# Altium project F3000.PrjPCB
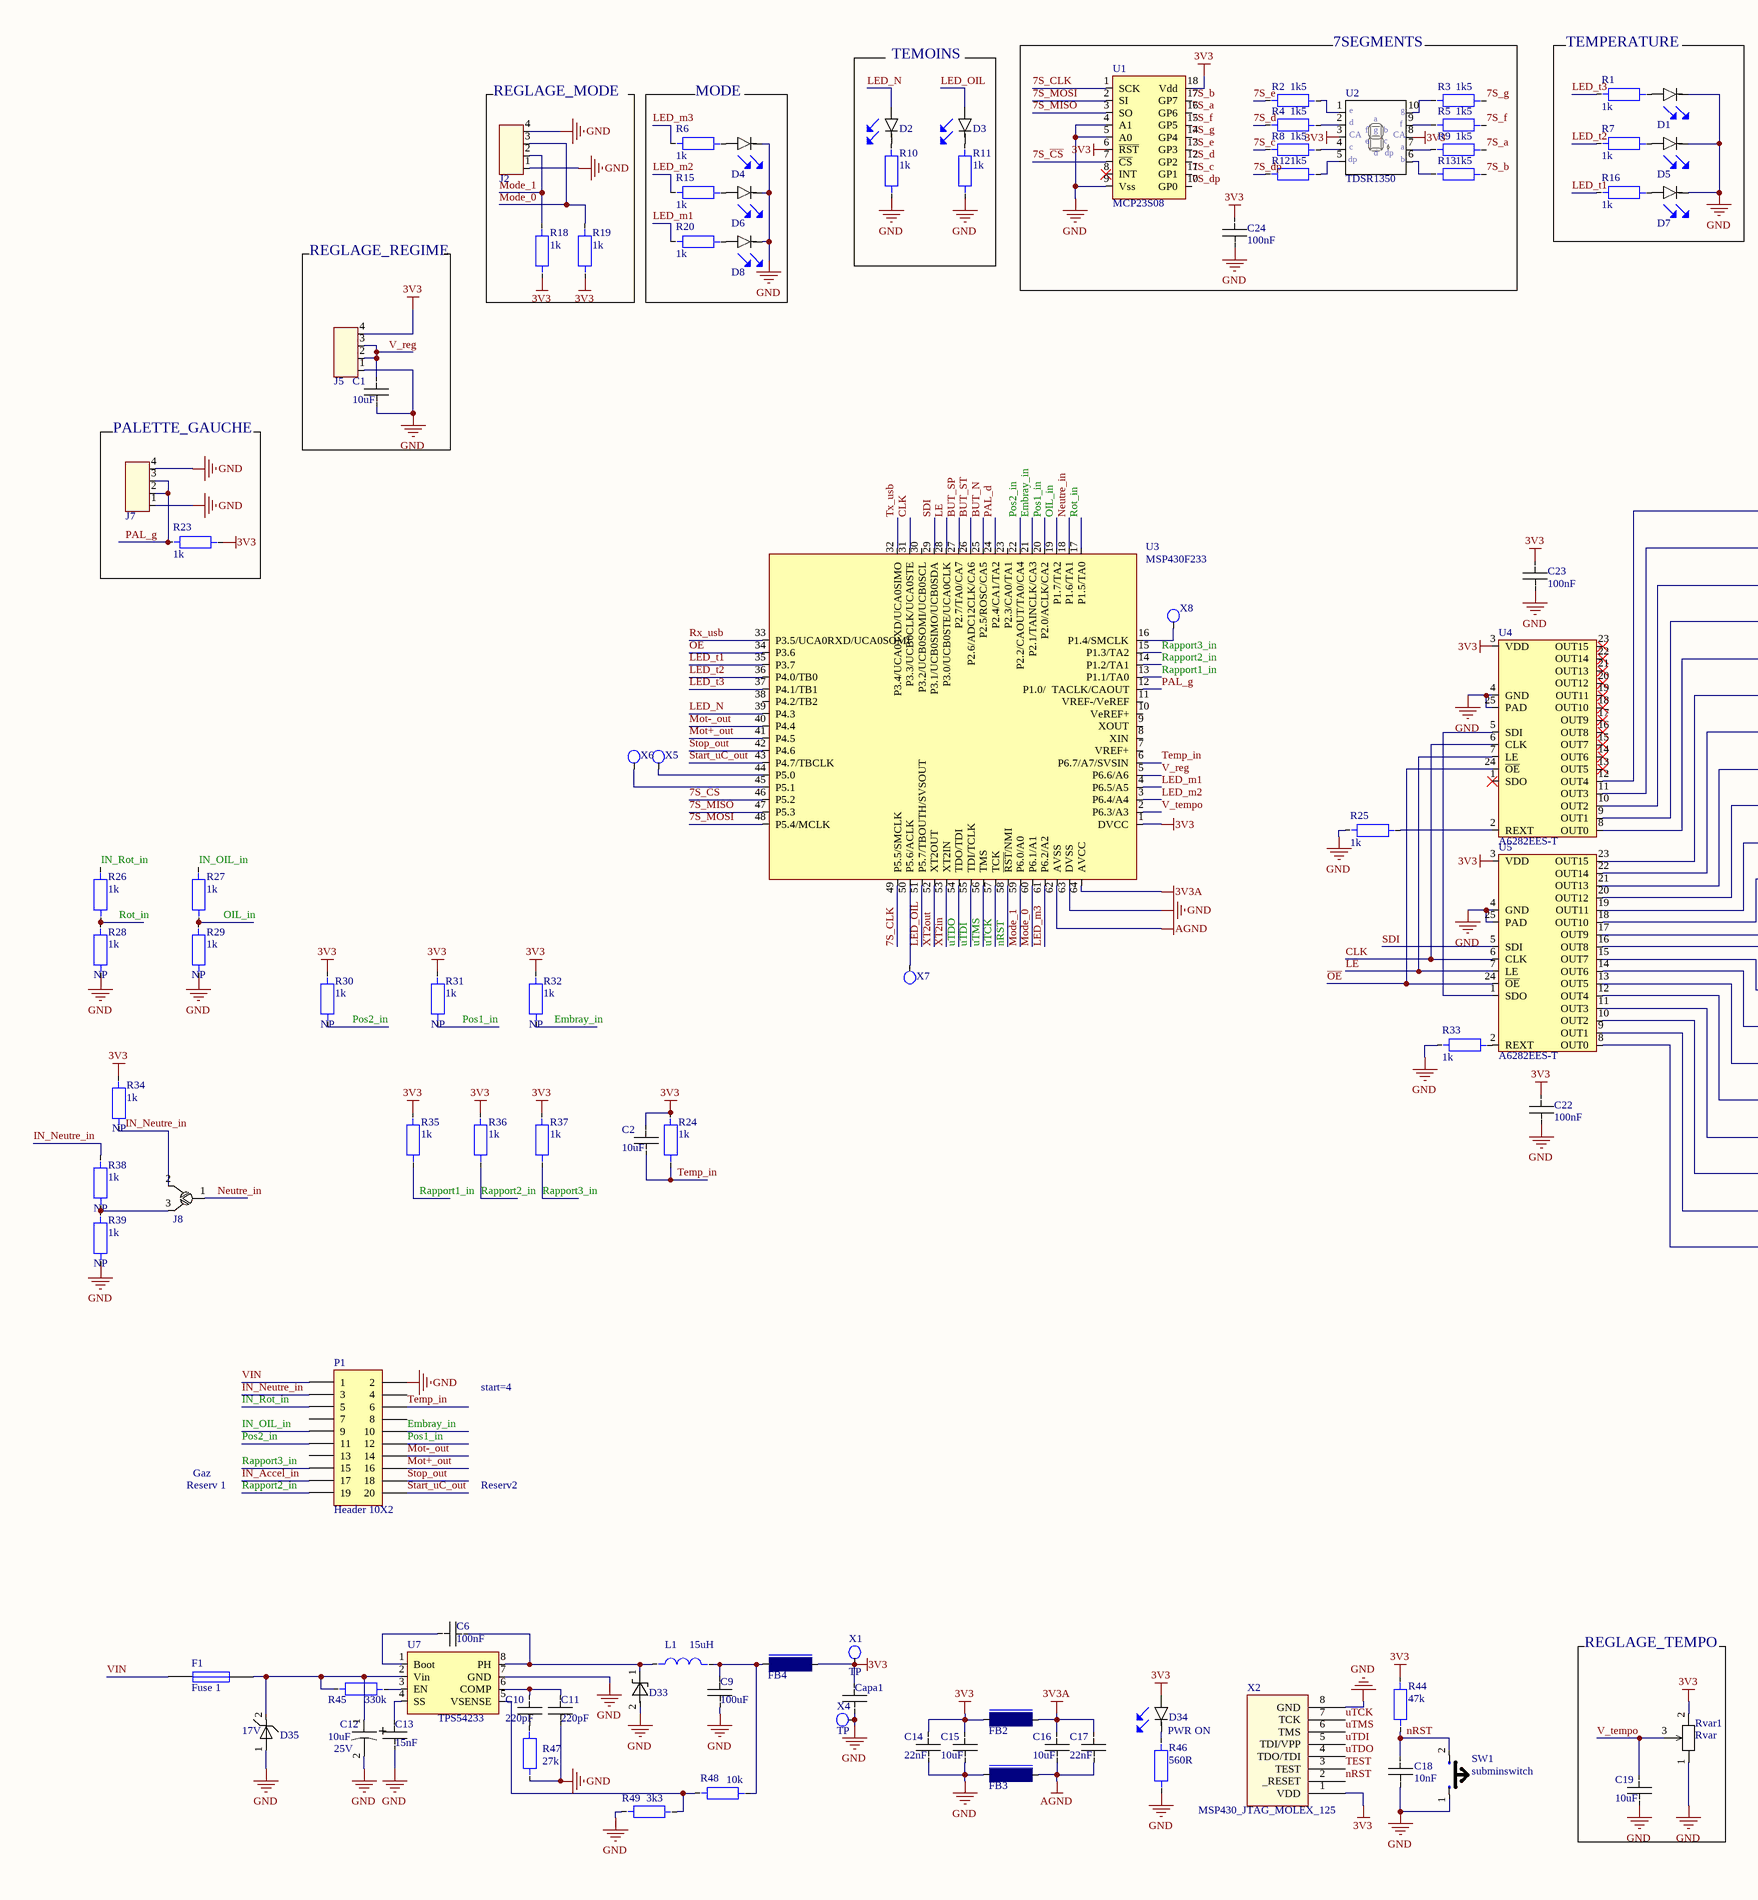
[diagram p0: scheme.SchDoc, left]
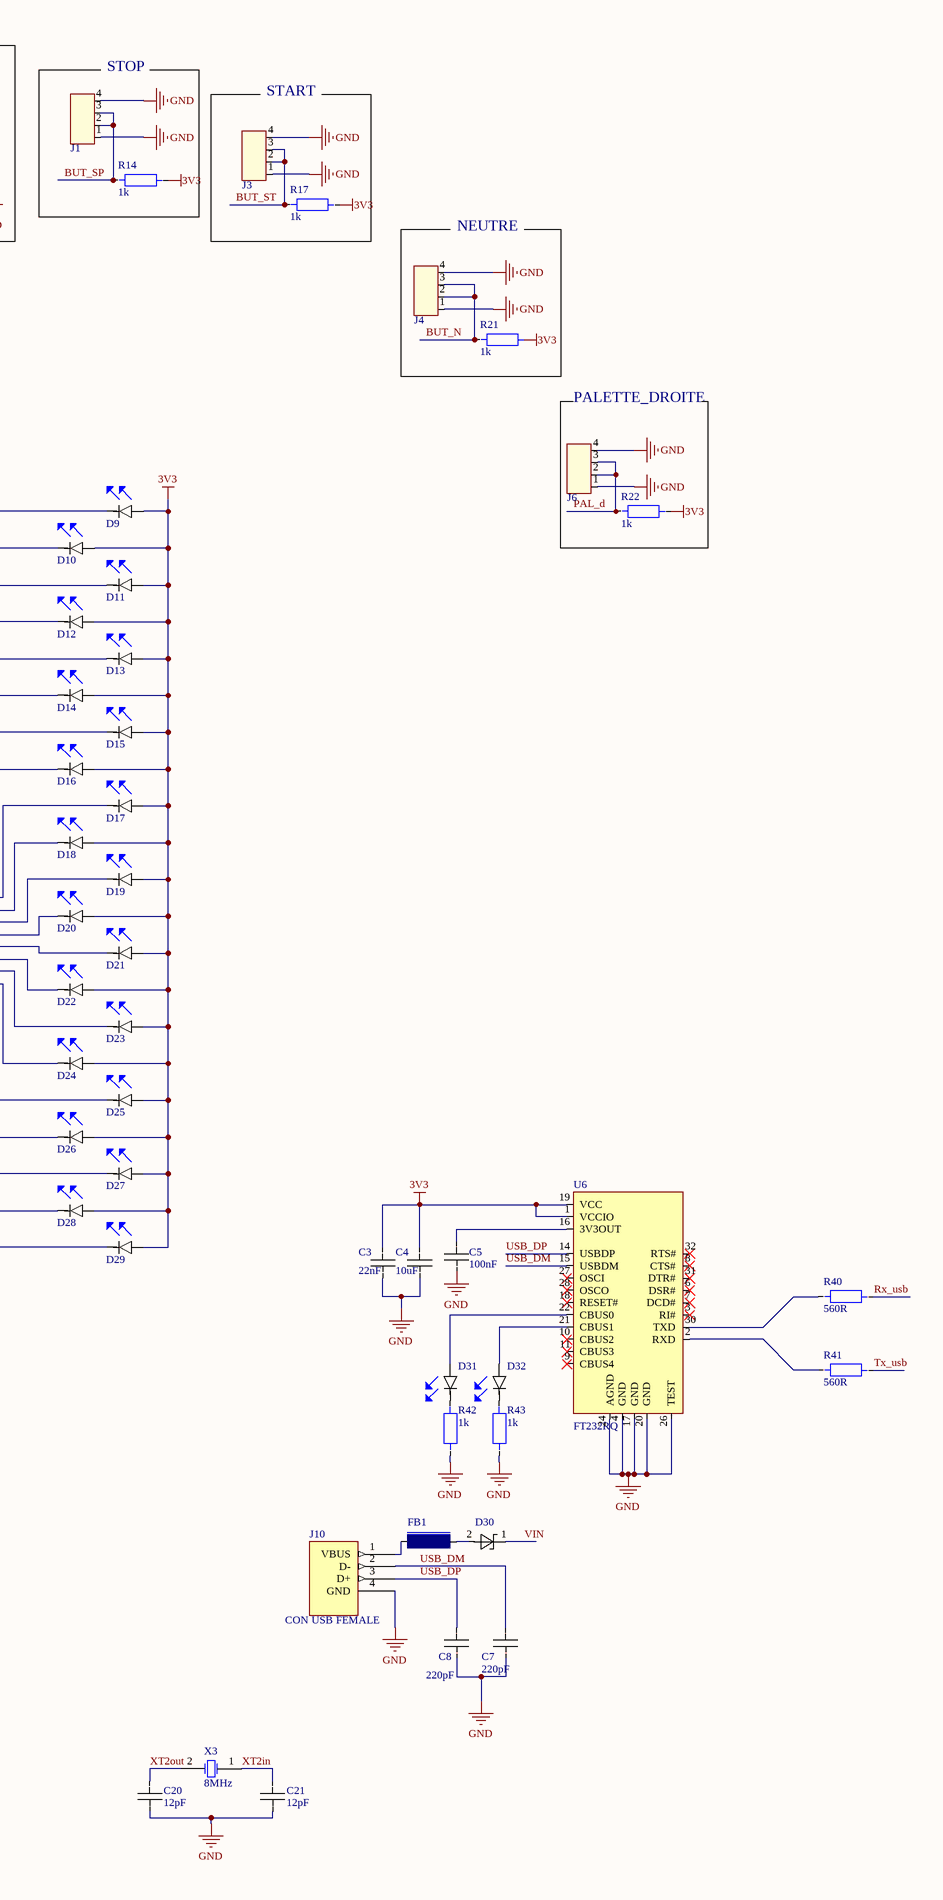
[diagram p1: scheme.SchDoc, right]
1 sheet, 142 parts. Net scope: global (net labels, ports and power ports of the same name join across sheets).
Board file: pcb.PcbDoc

## Sheet scheme.SchDoc
size A2; PageSetup: Record=PageOptions|CenterHorizontal=True|CenterVertical=True|PrintScale=0.50|XCorrection=1.00|YCorrection=1.00|PrintKind=1|BorderSize=5000000|LeftOffset=0|BottomOffset=0|Orientation=2|PaperLength=1000|PaperWidth=1000|Scale=100|PaperSource=7|PrintQuality=600|MediaType=1|DitherType=10|PaperKind=A4 (210 x 297 mm)|PrintScaleMode=1

### Parts
C1  value 10uF  [0603c]  (hidden comment: C)
C2  value 10uF  [0402]  (hidden comment: C)
C3  value 22nF  [0603c]  (hidden comment: C)
C4  value 10uF  [0603c]  (hidden comment: C)
C5  value 100nF  [0603c]  (hidden comment: C)
C6  value 100nF  [0603c]  (hidden comment: C)
C7  value 220pF  [0603c]  (hidden comment: C)
C8  value 220pF  [0603c]  (hidden comment: C)
C9  value 100uF  [1206]  (hidden comment: C)
C10  value 220pF  [0603c]  (hidden comment: C)
C11  value 220pF  [0603c]  (hidden comment: C)
C12  value 10uF  Voltage: 25V  [Cpol]  (hidden comment: C_pol)
C13  value 15nF  [0603c]  (hidden comment: C)
C14  value 22nF  [0603c]  (hidden comment: C)
C15  value 10uF  [0603c]  (hidden comment: C)
C16  value 10uF  [0603c]  (hidden comment: C)
C17  value 22nF  [0603c]  (hidden comment: C)
C18  value 10nF  [0603c]  (hidden comment: C)
C19  value 10uF  [0603c]  (hidden comment: C)
C20  value 12pF  [0603c]  (hidden comment: C)
C21  value 12pF  [0603c]  (hidden comment: C)
C22  value 100nF  [0603c]  (hidden comment: C)
C23  value 100nF  [0603c]  (hidden comment: C)
C24  value 100nF  [0603c]  (hidden comment: C)
Capa1  C  [0603c]  (value not drawn)
D1  led  [LED5MM]  (value not drawn)
D2  led  [LED5MM]  (value not drawn)
D3  led  [LED5MM]  (value not drawn)
D4  led  [LED3mm]  (value not drawn)
D5  led  [LED3mm]  (value not drawn)
D6  led  [LED3mm]  (value not drawn)
D7  led  [LED3mm]  (value not drawn)
D8  led  [LED3mm]  (value not drawn)
D9  led  [LED3mm]  (value not drawn)
D10  led  [LED3mm]  (value not drawn)
D11  led  [LED3mm]  (value not drawn)
D12  led  [LED3mm]  (value not drawn)
D13  led  [LED3mm]  (value not drawn)
D14  led  [LED3mm]  (value not drawn)
D15  led  [LED3mm]  (value not drawn)
D16  led  [LED3mm]  (value not drawn)
D17  led  [LED3mm]  (value not drawn)
D18  led  [LED3mm]  (value not drawn)
D19  led  [LED3mm]  (value not drawn)
D20  led  [LED3mm]  (value not drawn)
D21  led  [LED3mm]  (value not drawn)
D22  led  [LED3mm]  (value not drawn)
D23  led  [LED3mm]  (value not drawn)
D24  led  [LED3mm]  (value not drawn)
D25  led  [LED3mm]  (value not drawn)
D26  led  [LED3mm]  (value not drawn)
D27  led  [LED3mm]  (value not drawn)
D28  led  [LED3mm]  (value not drawn)
D29  led  [LED3mm]  (value not drawn)
D30  Schottky  [SOD323]  (value not drawn)
D31  led  [0805]  (value not drawn)
D32  led  [0805]  (value not drawn)
D33  Schottky  [SOD323]  (value not drawn)
D34  utility: PWR ON  [0805]  (hidden comment: led)
D35  Vz: 17V  [R_dil_vertical]  (hidden comment: Zener)
F1  Fuse 1  [R_DIL_vertical]
FB1  FB  [0805]  (value not drawn)
FB2  FB  [0805]  (value not drawn)
FB3  FB  [0805]  (value not drawn)
FB4  FB  [0805]  (value not drawn)
J1  MOLEX_embase_4_voies  [MOLEX53047-0410]  (value not drawn)
J2  MOLEX_embase_4_voies  [MOLEX53047-0410]  (value not drawn)
J3  MOLEX_embase_4_voies  [MOLEX53047-0410]  (value not drawn)
J4  MOLEX_embase_4_voies  [MOLEX53047-0410]  (value not drawn)
J5  MOLEX_embase_4_voies  [MOLEX53047-0410]  (value not drawn)
J6  MOLEX_embase_4_voies  [MOLEX53047-0410]  (value not drawn)
J7  MOLEX_embase_4_voies  [MOLEX53047-0410]  (value not drawn)
J8  solder_bridge_3  [solder_bridge_3]  (value not drawn)
J10  CON USB FEMALE  [mini_USB_vertical]
L1  value 15uH  [C1812]  (hidden comment: L)
P1  Header 10X2  [header2x10]
R1  value 1k  [0603c]  (hidden comment: R)
R2  value 1k5  [0603c]  (hidden comment: R)
R3  value 1k5  [0603c]  (hidden comment: R)
R4  value 1k5  [0603c]  (hidden comment: R)
R5  value 1k5  [0603c]  (hidden comment: R)
R6  value 1k  [0603c]  (hidden comment: R)
R7  value 1k  [0603c]  (hidden comment: R)
R8  value 1k5  [0603c]  (hidden comment: R)
R9  value 1k5  [0603c]  (hidden comment: R)
R10  value 1k  [0603c]  (hidden comment: R)
R11  value 1k  [0603c]  (hidden comment: R)
R12  value 1k5  [0603c]  (hidden comment: R)
R13  value 1k5  [0603c]  (hidden comment: R)
R14  value 1k  [0603c]  (hidden comment: R)
R15  value 1k  [0603c]  (hidden comment: R)
R16  value 1k  [0603c]  (hidden comment: R)
R17  value 1k  [0603c]  (hidden comment: R)
R18  value 1k  [0603c]  (hidden comment: R)
R19  value 1k  [0603c]  (hidden comment: R)
R20  value 1k  [0603c]  (hidden comment: R)
R21  value 1k  [0603c]  (hidden comment: R)
R22  value 1k  [0603c]  (hidden comment: R)
R23  value 1k  [0603c]  (hidden comment: R)
R24  value 1k  [0402]  (hidden comment: R)
R25  value 1k  [0603c]  (hidden comment: R)
R26  value 1k  [0402]  (hidden comment: R)
R27  value 1k  [0402]  (hidden comment: R)
R28  value 1k  Status: NP  [0402]  (hidden comment: R)
R29  value 1k  Status: NP  [0402]  (hidden comment: R)
R30  value 1k  Status: NP  [0402]  (hidden comment: R)
R31  value 1k  Status: NP  [0402]  (hidden comment: R)
R32  value 1k  Status: NP  [0402]  (hidden comment: R)
R33  value 1k  [0603c]  (hidden comment: R)
R34  value 1k  Status: NP  [0402]  (hidden comment: R)
R35  value 1k  [0402]  (hidden comment: R)
R36  value 1k  [0402]  (hidden comment: R)
R37  value 1k  [0402]  (hidden comment: R)
R38  value 1k  Status: NP  [0402]  (hidden comment: R)
R39  value 1k  Status: NP  [0402]  (hidden comment: R)
R40  value 560R  [0603c]  (hidden comment: R)
R41  value 560R  [0603c]  (hidden comment: R)
R42  value 1k  [0603c]  (hidden comment: R)
R43  value 1k  [0603c]  (hidden comment: R)
R44  value 47k  [0603c]  (hidden comment: R)
R45  value 330k  [0603c]  (hidden comment: R)
R46  value 560R  [0603c]  (hidden comment: R)
R47  value 27k  [0603c]  (hidden comment: R)
R48  value 10k  [0603c]  (hidden comment: R)
R49  value 3k3  [0603c]  (hidden comment: R)
Rvar1  Rvar  [TC33X-2]
SW1  subminswitch  [microswitch]
U1  MCP23S08  [SOIC18]
U2  TDSR1350  [TDSR1350]
U3  MSP430F233  [PQFP-64]
U4  A6282EES-T  [QFN24]
U5  A6282EES-T  [QFN24]
U6  FT232RQ  [FT232RQ_QFN32_M]
U7  TPS54233  [SOIC127P600-8M]
X1  TP  [TP]
X2  MSP430_JTAG_MOLEX_125  [JTAG_MSP_SMALL]
X3  8MHz  [Quartz_2]
X4  TP  [TP]
X5  TP  [cms_pad]  (value not drawn)
X6  TP  [cms_pad]  (value not drawn)
X7  TP  [cms_pad]  (value not drawn)
X8  TP  [cms_pad]  (value not drawn)

### Nets
3V3: C2.1 C3.1 C4.1 C14.1 C15.1 C22.1 C23.1 C24.1 Capa1.1 D9.1 D10.1 D11.1 D12.1 D13.1 D14.1 D15.1 D16.1 D17.1 D18.1 D19.1 D20.1 D21.1 D22.1 D23.1 D24.1 D25.1 D26.1 D27.1 D28.1 D29.1 D34.1 FB2.1 FB4.2 J5.4 R14.2 R17.2 R18.1 R19.1 R21.2 R22.2 R23.2 R24.2 R30.2 R31.2 R32.2 R34.2 R35.2 R36.2 R37.2 R44.2 Rvar1.2 U1.6(~{RST}) U1.18(Vdd) U2.3 U2.8 U3.1(DVCC) U4.3(VDD) U5.3(VDD) U6.1(VCCIO) U6.19(VCC) X1.1 X2.1(VDD)
3V3A: C16.1 C17.1 FB2.2 U3.64(AVCC)
AGND: C16.2 C17.2 FB3.2 U3.62(AVSS)
GND: C1.2 C3.2 C4.2 C5.2 C7.2 C8.2 C9.2 C11.2 C12.2 C13.2 C14.2 C15.2 C18.1 C19.2 C20.2 C21.2 C22.2 C23.2 C24.2 Capa1.2 D1.2 D4.2 D5.2 D6.2 D7.2 D8.2 D33.2 D35.1 FB3.1 J1.1 J1.4 J2.1 J2.4 J3.1 J3.4 J4.1 J4.4 J5.1 J6.1 J6.4 J7.1 J7.4 J10.4(GND) J10.5(SHIELD) J10.6(SHIELD) P1.2 R10.2 R11.2 R25.2 R28.1 R29.1 R33.2 R39.1 R42.1 R43.1 R46.2 R47.2 R49.1 Rvar1.1 SW1.1 U1.4(A1) U1.5(A0) U1.9(Vss) U3.63(DVSS) U4.4(GND) U4.25(PAD) U5.4(GND) U5.25(PAD) U6.4(GND) U6.17(GND) U6.20(GND) U6.24(AGND) U6.26(TEST) U7.7(GND) X2.8(GND) X4.1
7S_a: R9.2 U1.16(GP6)
7S_b: R13.2 U1.17(GP7)
7S_c: R8.1 U1.11(GP1)
7S_~{CS}: U1.7(~{CS}) U3.46(P5.2)
7S_CLK: U1.1(SCK) U3.49(P5.5/SMCLK)
7S_d: R4.1 U1.12(GP2)
7S_dp: R12.1 U1.10(GP0)
7S_e: R2.1 U1.13(GP3)
7S_f: R5.2 U1.15(GP5)
7S_g: R3.2 U1.14(GP4)
7S_MISO: U1.3(SO) U3.47(P5.3)
7S_MOSI: U1.2(SI) U3.48(P5.4/MCLK)
BUT_N: J4.2 J4.3 R21.1 U3.25(P2.5/ROSC/CA5)
BUT_SP: J1.2 J1.3 R14.1 U3.27(P2.7/TA0/CA7)
BUT_ST: J3.2 J3.3 R17.1 U3.26(P2.6/ADC12CLK/CA6)
CLK: U3.31(P3.3/UCB0CLK/UCA0STE) U4.6(CLK) U5.6(CLK)
Embray_in: P1.10 R32.1 U3.21(P2.1/TAINCLK/CA3)
IN_Accel_in: P1.17
IN_Neutre_in: J8.2 P1.3 R34.1 R38.2
IN_OIL_in: P1.9 R27.2
IN_Rot_in: P1.5 R26.2
LE: U3.28(P3.0/UCB0STE/UCA0CLK) U4.7(LE) U5.7(LE)
LED_m1: R20.2 U3.4(P6.5/A5)
LED_m2: R15.2 U3.3(P6.4/A4)
LED_m3: R6.2 U3.61(P6.2/A2)
LED_N: D2.1 U3.39(P4.3)
LED_OIL: D3.1 U3.51(P5.7/TBOUTH/SVSOUT)
LED_t1: R16.2 U3.35(P3.7)
LED_t2: R7.2 U3.36(P4.0/TB0)
LED_t3: R1.2 U3.37(P4.1/TB1)
Mode_0: J2.3 R19.2 U3.60(P6.1/A1)
Mode_1: J2.2 R18.2 U3.59(P6.0/A0)
Mot+_out: P1.16 U3.41(P4.5)
Mot-_out: P1.14 U3.40(P4.4)
Neutre_in: J8.1 U3.18(P1.6/TA1)
nRST: C18.2 R44.1 SW1.2 U3.58(~{RST}/NMI) X2.2(_RESET)
~{OE}: U3.34(P3.6) U4.24(~{OE}) U5.24(~{OE})
OIL_in: R27.1 R29.2 U3.19(P1.7/TA2)
PAL_d: J6.2 J6.3 R22.1 U3.24(P2.4/CA1/TA2)
PAL_g: J7.2 J7.3 R23.1 U3.12(P1.0/__TACLK/CAOUT)
Pos1_in: P1.12 R31.1 U3.20(P2.0/ACLK/CA2)
Pos2_in: P1.11 R30.1 U3.22(P2.2/CAOUT/TA0/CA4)
Rapport1_in: R35.1 U3.13(P1.1/TA0)
Rapport2_in: P1.19 R36.1 U3.14(P1.2/TA1)
Rapport3_in: P1.15 R37.1 U3.15(P1.3/TA2)
Rot_in: R26.1 R28.2 U3.17(P1.5/TA0)
Rx_usb: R40.2 U3.33(P3.5/UCA0RXD/UCA0SOMI)
SDI: U3.29(P3.1/UCB0SIMO/UCB0SDA) U5.5(SDI)
Start_uC_out: P1.20 U3.43(P4.7/TBCLK)
Stop_out: P1.18 U3.42(P4.6)
Temp_in: C2.2 P1.6 R24.1 U3.6(P6.7/A7/SVSIN)
TEST: X2.3(TEST)
Tx_usb: R41.2 U3.32(P3.4/UCA0TXD/UCA0SIMO)
USB_DM: C7.1 J10.2(D-) U6.15(USBDM)
USB_DP: C8.1 J10.3(D+) U6.14(USBDP)
uTCK: U3.57(TCK) X2.7(TCK)
uTDI: U3.55(TDI/TCLK) X2.5(TDI/VPP)
uTDO: U3.54(TDO/TDI) X2.4(TDO/TDI)
uTMS: U3.56(TMS) X2.6(TMS)
V_reg: C1.1 J5.2 J5.3 U3.5(P6.6/A6)
V_tempo: C19.1 Rvar1.3 U3.2(P6.3/A3)
VIN: D30.1 F1.1 P1.1
XT2in: C21.1 U3.53(XT2IN) X3.1(OSC1)
XT2out: C20.1 U3.52(XT2OUT) X3.2(OSC2)
NetC5_1: C5.1 U6.16(3V3OUT)
NetC6_1: C6.1 U7.1(Boot)
NetC6_2: C6.2 D33.1 L1.1 U7.8(PH)
NetC9_1: C9.1 FB4.1 L1.2 R48.2
NetC10_1: C10.1 C11.1 U7.6(COMP)
NetC10_2: C10.2 R47.1
NetC12_1: C12.1 D35.2 F1.2 R45.1 U7.2(Vin)
NetC13_1: C13.1 U7.4(SS)
NetD1_1: D1.1 R1.1
NetD2_2: D2.2 R10.1
NetD3_2: D3.2 R11.1
NetD4_1: D4.1 R6.1
NetD5_1: D5.1 R7.1
NetD6_1: D6.1 R15.1
NetD7_1: D7.1 R16.1
NetD8_1: D8.1 R20.1
NetD9_2: D9.2 U4.12(OUT4)
NetD10_2: D10.2 U4.11(OUT3)
NetD11_2: D11.2 U4.10(OUT2)
NetD12_2: D12.2 U4.9(OUT1)
NetD13_2: D13.2 U4.8(OUT0)
NetD14_2: D14.2 U5.23(OUT15)
NetD15_2: D15.2 U5.22(OUT14)
NetD16_2: D16.2 U5.21(OUT13)
NetD17_2: D17.2 U5.20(OUT12)
NetD18_2: D18.2 U5.19(OUT11)
NetD19_2: D19.2 U5.18(OUT10)
NetD20_2: D20.2 U5.17(OUT9)
NetD21_2: D21.2 U5.16(OUT8)
NetD22_2: D22.2 U5.15(OUT7)
NetD23_2: D23.2 U5.14(OUT6)
NetD24_2: D24.2 U5.13(OUT5)
NetD25_2: D25.2 U5.12(OUT4)
NetD26_2: D26.2 U5.11(OUT3)
NetD27_2: D27.2 U5.10(OUT2)
NetD28_2: D28.2 U5.9(OUT1)
NetD29_2: D29.2 U5.8(OUT0)
NetD30_2: D30.2 FB1.2
NetD31_1: D31.1 U6.22(CBUS0)
NetD31_2: D31.2 R42.2
NetD32_1: D32.1 U6.21(CBUS1)
NetD32_2: D32.2 R43.2
NetD34_2: D34.2 R46.1
NetFB1_1: FB1.1 J10.1(VBUS)
NetJ8_3: J8.3 R38.1 R39.2
NetR2_2: R2.2 U2.1
NetR3_1: R3.1 U2.10
NetR4_2: R4.2 U2.2
NetR5_1: R5.1 U2.9
NetR8_2: R8.2 U2.4
NetR9_1: R9.1 U2.7
NetR12_2: R12.2 U2.5
NetR13_1: R13.1 U2.6
NetR25_1: R25.1 U4.2(REXT)
NetR33_1: R33.1 U5.2(REXT)
NetR40_1: R40.1 U6.30(TXD)
NetR41_1: R41.1 U6.2(RXD)
NetR45_2: R45.2 U7.3(EN)
NetR48_1: R48.1 R49.2 U7.5(VSENSE)
NetU3_16: U3.16(P1.4/SMCLK) X8.1
NetU3_44: U3.44(P5.0) X5.1
NetU3_45: U3.45(P5.1) X6.1
NetU3_50: U3.50(P5.6/ACLK) X7.1
NetU4_5: U4.5(SDI) U5.1(SDO)

Not connected (* = marked no-connect by the designer): P1 4 7 8 13; U1 8(INT)*; U3 7(VREF+) 8(XIN) 9(XOUT) 10(VeREF+) 11(VREF-/VeREF) 23(P2.3/CA0/TA1) 30(P3.2/UCB0SOMI/UCB0SCL) 38(P4.2/TB2); U4 1(SDO)* 13(OUT5)* 14(OUT6)* 15(OUT7)* 16(OUT8)* 17(OUT9)* 18(OUT10)* 19(OUT11)* 20(OUT12)* 21(OUT13)* 22(OUT14)* 23(OUT15)*; U6 3(RI#)* 5(NC) 6(DSR#)* 7(DCD#)* 8(CTS#)* 9(CBUS4)* 10(CBUS2)* 11(CBUS3)* 12(NC) 13(NC) 18(RESET#)* 23(NC) 25(NC) 27(OSCI)* 28(OSCO)* 29(NC) 31(DTR#)* 32(RTS#)*

### Notes on the sheet
- TEMOINS
- 7SEGMENTS
- TEMPERATURE
- (near J1) STOP
- (near J2) REGLAGE_MODE
- MODE
- (near J3) START
- REGLAGE_REGIME
- (near J4) NEUTRE
- (near J7) PALETTE_GAUCHE
- (near J6) PALETTE_DROITE
- start=4
- Reserv 1
- Gaz
- Reserv2
- REGLAGE_TEMPO
- (in symbol TDSR1350) e; g; a; d; f; b; CA; c; dp

### Library data of the parts
C9 = C: Voltage: 25V; Supplier 1: Farnell; Supplier Part Number 1: 1358552
C18 = C: Voltage: 50V; Fabricant: Kemet; Farnell ref: 1414609; Supplier 1: Farnell; Supplier Part Number 1: 1284119
Capa1 = C: value: 10uF; Supplier 1: Farnell; Supplier Part Number 1: 1844199
D34 = led: Color: Blue; Farnell ref: 1685096; Supplier 1: Farnell; Supplier Part Number 1: 1685096
F1 = Fuse 1: Fuse; Published: 8-Jun-2000; LatestRevisionDate: 17-Jul-2002; LatestRevisionNote: Re-released for DXP Platform.; PackageReference: PIN-W2/E2.8; Publisher: Altium Limited; Farnell ref: 1202387; Supplier 1: Farnell; Supplier Part Number 1: 1202387
J1-J7 = MOLEX_embase_4_voies: 53047-0410 MOLEX; Farnell ref: 9733060; Supplier 1: Farnell; Supplier Part Number 1: 9733060
J10 = CON USB FEMALE: connecteur usb femelle; Supplier 1: Farnell; Supplier Part Number 1: 1841175
P1 = Header 10X2: Header, 10-Pin, Dual row; LatestRevisionDate: 17-Jul-2002; LatestRevisionNote: Re-released for DXP Platform.; Publisher: Altium Limited
SW1 = subminswitch: subminiature tact switch for SMT; Farnell ref: 1437634; Price: 0.46 Euro/1pce; Supplier 1: Farnell; Supplier Part Number 1: 1437634
U1 = MCP23S08: SPI 8 IO expander; Farnell ref: 1332092; Supplier 1: Farnell; Supplier Part Number 1: 1332092
U2 = TDSR1350: Distrelec ref: 6601107
U6 = FT232RQ: QFN32 UART-USB bridge; Prix: 5.72 Euro/1pce; Farnell ref: 1146033; Digikey ref: 768-1008-1-ND; Supplier 1: Farnell; Supplier Part Number 1: 1146033
X2 = MSP430_JTAG_MOLEX_125: Part number: 1012258; Supplier: Farnell; Unit price: 2.05; Supplier 1: Farnell; Supplier Part Number 1: 1012258
X3 = Quartz: Quartz smd; Distrelec order code: *; Manufacturer: *; Farnell ref: 1611765; Supplier 1: Farnell; Supplier Part Number 1: 1611765
C1-C8 C10 C11 C13-C17 C19-C24 = C: Supplier 1: Farnell
  C1 C15 C16 C19: Farnell ref: 1759393RL; Supplier Part Number 1: 1844199
  C2: Farnell ref: 1759393RL; Supplier Part Number 1: 1889260
  C3 C14 C17: Farnell ref: 431941; Supplier Part Number 1: 1865548
  C4: Farnell ref: 1833804; Digikey ref: 445-4112-1-ND; Supplier Part Number 1: 1844199
  C5 C6 C22-C24: Farnell ref: 317287; Supplier Part Number 1: 1833863
  C7 C8 C10 C11: Farnell ref: 1759071; Supplier Part Number 1: 1284114
  C13: Farnell ref: 1740537; Supplier Part Number 1: 1740537
  C20 C21: Farnell ref: 1462447; Digikey ref: 445-1270-1-ND; Supplier Part Number 1: 1462447
C12 = C_pol: Farnell ref: 9452486; Supplier 1: Farnell; Supplier Part Number 1: 9452486
D1-D29 D31 D32 = led
  D9-D29: Farnell ref: 1699413
  D31 D32: Farnell ref: 1699409; Supplier 1: Farnell; Supplier Part Number 1: 1652078
D30 D33 = Schottky: Farnell ref: 1757764; Supplier 1: Farnell; Supplier Part Number 1: 1757764
D35 = Zener: Farnell ref: 9558128; Supplier 1: Farnell; Supplier Part Number 1: 9558128
FB1-FB4 = FB: Farnell ref: 1515660; Supplier 1: Farnell; Supplier Part Number 1: 1515660
L1 = L: Farnell ref: 1515461; Supplier 1: Farnell; Supplier Part Number 1: 1515461
R1-R49 = R: Supplier 1: Farnell
  R1 R6 R7 R10 R11 R14-R22: Farnell ref: 1652848; Supplier 2: Farnell; Supplier Part Number 2: 1627748; Supplier Part Number 1: 1469740
  R2-R5 R8 R9 R12 R13: Farnell ref: 1652848; Supplier Part Number 1: 1500597
  R23 R25 R33: Farnell ref: 1652848; Supplier Part Number 1: 1469740
  R24 R27-R30: Farnell ref: 1652848; Supplier Part Number 1: 1750672; Supplier 2: Farnell; Supplier Part Number 2: 1652766
  R26 R31 R34-R39: Farnell ref: 1652848; Supplier Part Number 1: 1652766
  R32: Supplier Part Number 1: 1652766
  R40 R41: Farnell ref: 1652891; Digikey ref: P560HCT-ND; Supplier Part Number 1: 1500642RL
  R42 R43: Farnell ref: 1652848; Digikey ref: P1.00KHCT-ND; Supplier 2: Farnell; Supplier Part Number 2: 1627748; Supplier Part Number 1: 1469740
  R44: Farnell ref: 1697398; Supplier Part Number 1: 1652881
  R45: Supplier Part Number 1: 1500626RL
  R46: Farnell ref: 1652891; Supplier Part Number 1: 1500642RL
  R47: Farnell ref: 1577625; Supplier Part Number 1: 1652864RL
  R48: Supplier Part Number 1: 1652719
  R49: Supplier Part Number 1: 1353167
Rvar1 = Rvar: Farnell ref: 1689867; Supplier 1: Farnell; Supplier Part Number 1: 1689867
U3 = MSP430F233: Farnell ref: 1649428; Supplier 1: Farnell; Supplier Part Number 1: 1649448
U4 U5 = A6282EES-T: Farnell ref: 1650235; Supplier 1: Farnell; Supplier Part Number 1: 1650235
U7 = TPS54233: Farnell ref: 1755639; Supplier 1: Farnell; Supplier Part Number 1: 1755639